# EAGLE design badge (EAGLE 7.1.0)
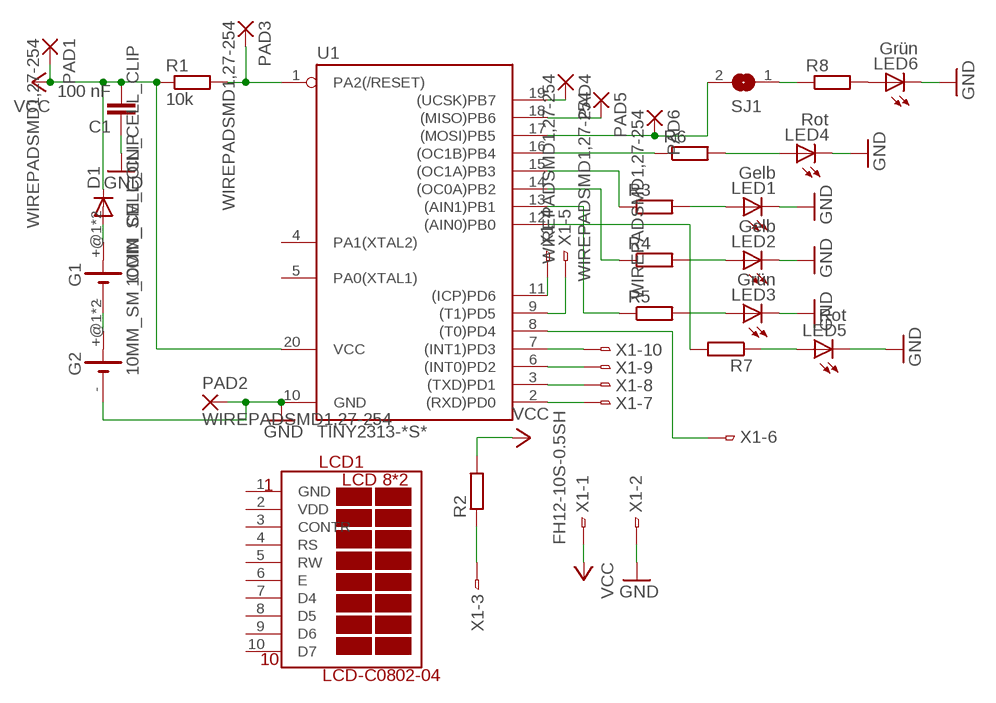
[diagram p0: schematic, sheet 1]

## Parts
C1  100 nF  C-EUC0805  [C0805]
D1  DIODE-MELF-MLL41  [MELF-MLL41]
G1  10MM_SM_COIN_CELL_CLIP  [10MM_SM_COIN_CELL_CLIP]
G2  10MM_SM_COIN_CELL_CLIP  [10MM_SM_COIN_CELL_CLIP]
LCD1  LCD-C0802-04  [LCD-C0802-04]
LED1  Gelb  LEDSML0603  [SML0603]
LED2  Gelb  LEDSML0603  [SML0603]
LED3  Grün  LEDSML0603  [SML0603]
LED4  Rot  LEDSML0603  [SML0603]
LED5  Rot  LEDSML0603  [SML0603]
LED6  Grün  LEDSML0603  [SML0603]
PAD1  WIREPADSMD1,27-254  [SMD1,27-2,54]
PAD2  WIREPADSMD1,27-254  [SMD1,27-2,54]
PAD3  WIREPADSMD1,27-254  [SMD1,27-2,54]
PAD4  WIREPADSMD1,27-254  [SMD1,27-2,54]
PAD5  WIREPADSMD1,27-254  [SMD1,27-2,54]
PAD6  WIREPADSMD1,27-254  [SMD1,27-2,54]
R1  10k  R-EU_R0805  [R0805]
R2  R-EU_R0805  [R0805]
R3  R-EU_R0603  [R0603]
R4  R-EU_R0805  [R0805]
R5  R-EU_R0805  [R0805]
R6  R-EU_R0805  [R0805]
R7  R-EU_R0805  [R0805]
R8  R-EU_R0805  [R0805]
SJ1  SJ  [SJ]
U1  TINY2313-*S*  [SO20L$]
X1  FH12-10S-0.5SH  [FH12-10S-0.5SH]

## Nets
GND: C1.1 G2.- LED1.C LED2.C LED3.C LED4.C LED5.C LED6.C PAD2.1(P) U1.10(GND) X1.2
N$1: PAD3.1(P) R1.2 U1.1(PA2(/RESET))
N$2: PAD5.1(P) U1.18((MISO)PB6)
N$3: PAD6.1(P) SJ1.2 U1.17((MOSI)PB5)
N$4: PAD4.1(P) U1.19((UCSK)PB7)
N$5: LED6.A R8.2
N$6: LED3.A R5.2
N$7: LED2.A R4.2
N$8: G1.- G2.+@1(+) G2.+@2(+)
N$9: LED4.A R6.2
N$10: R6.1 U1.16((OC1B)PB4)
N$11: R3.1 U1.15((OC1A)PB3)
N$12: R4.1 U1.14((OC0A)PB2)
N$13: R5.1 U1.13((AIN1)PB1)
N$14: U1.2((RXD)PD0) X1.7
N$15: U1.3((TXD)PD1) X1.8
N$16: U1.6((INT0)PD2) X1.9
N$17: U1.7((INT1)PD3) X1.10
N$18: U1.8((T0)PD4) X1.6
N$19: U1.9((T1)PD5) X1.5
N$20: U1.11((ICP)PD6) X1.4
N$21: R2.1 X1.3
N$24: R8.1 SJ1.1
N$36: LED1.A R3.2
N$37: D1.A G1.+@1(+) G1.+@2(+)
N$39: LED5.A R7.1
N$40: R7.2 U1.12((AIN0)PB0)
VCC: C1.2 D1.C PAD1.1(P) R1.1 R2.2 U1.20(VCC) X1.1
Unconnected: LCD1.3(CONTR) LCD1.4(RS) LCD1.5(RW) LCD1.6(E) LCD1.7(D4) LCD1.8(D5) LCD1.9(D6) LCD1.10(D7) U1.4(PA1(XTAL2)) U1.5(PA0(XTAL1))

## Power pins joined to a net without a drawn wire
GND: LCD1.1(GND)
VDD: LCD1.2(VDD)

## Library data of the parts
C1 = rcl:C-EU: CAPACITOR, European symbol
D1 = diode:DIODE-: DIODE
G1 G2 = battery:10MM_SM_COIN_CELL_CLIP: Battery cell clip for CR927 Source: KEYSTONE ELECTRONICS CORP. www.keyelco.com, ASTORIA, N.Y. 11105-2017 PART ANME 10mm SM COIN CELl CLIP DWG NO. 3030
LCD1 = lcd-c0802-04:LCD-C0802-04: Pollin LCD Display mit 2 Zeilen mit je 8 Zeichen. Wird wie ein 16*2 angesteuert (nur die ersten 8 Zeichen werden dargestellt).
LED1-LED6 = led:LED: LED OSRAM: - CHIPLED LG R971, LG N971, LY N971, LG Q971, LY Q971, LO R971, LY R971 LH N974, LH R974 LS Q976, LO Q976, LY Q976 LO Q996 - Hyper CHIPLED LW Q18S LB Q993, LB Q99A, LB R99A - SideLED LS A670, LO A670, LY A670, LG A670, LP A670 LB A673, LV A673, LT A673, LW A673 LH A674 LY A675 LS A676, LA A676, LO A676, LY A676, LW A676 LS A679, LY A679, LG A679 - Hyper Micro SIDELED® LS Y876, LA Y876, LO Y876, LY Y876 LT Y87S - SmartLED LW L88C, LW L88S LB L89C, LB L89S, LG L890 LS L89K, LO L89K, LY L89K LS L896, LA L896, LO L896, LY L896 - TOPLED LS T670, LO T670, LY T670, LG T670, LP T670 LSG T670, LSP T670, LSY T670, LOP T670, LYG T670 LG T671, LOG T671, LSG T671 LB T673, LV T673, LT T673, LW T673 LH T674 LS T676, LA T676, LO T676, LY T676, LB T676, LH T676, LSB T676, LW T676 LB T67C, LV T67C, LT T67C, LS T67K, LO T67K, LY T67K, LW E67C LS E67B, LA E67B, LO E67B, LY E67B, LB E67C, LV E67C, LT E67C LW T67C LS T679, LY T679, LG T679 LS T770, LO T770, LY T770, LG T770, LP T770 LB T773, LV T773, LT T773, LW T773 LH T774 LS E675, LA E675, LY E675, LS T675 LS T776, LA T776, LO T776, LY T776, LB T776 LHGB T686 LT T68C, LB T68C - Hyper Mini TOPLED® LB M676 - Mini TOPLED Santana® LG M470 LS M47K, LO M47K, LY M47K Source: http://www.osram.convergy.de LUXEON: - LUMILED® LXK2-PW12-R00, LXK2-PW12-S00, LXK2-PW14-U00, LXK2-PW14-V00 LXK2-PM12-R00, LXK2-PM12-S00, LXK2-PM14-U00 LXK2-PE12-Q00, LXK2-PE12-R00, LXK2-PE12-S00, LXK2-PE14-T00, LXK2-PE14-U00 LXK2-PB12-K00, LXK2-PB12-L00, LXK2-PB12-M00, LXK2-PB14-N00, LXK2-PB14-P00, LXK2-PB14-Q00 LXK2-PR12-L00, LXK2-PR12-M00, LXK2-PR14-Q00, LXK2-PR14-R00 LXK2-PD12-Q00, LXK2-PD12-R00, LXK2-PD12-S00 LXK2-PH12-R00, LXK2-PH12-S00 LXK2-PL12-P00, LXK2-PL12-Q00, LXK2-PL12-R00 Source: www.luxeon.com KINGBRIGHT: KA-3528ASYC Source: www.kingbright.com
PAD1-PAD6 = wirepad:WIREPAD: Wire PAD connect wire on PCB
R1-R8 = resistor:R-EU_: RESISTOR, European symbol; SPICEPREFIX: R
SJ1 = jumper:SJ: SMD solder JUMPER
U1 = avr-6:TINY2313*: Atmel Tiny2313 2K Flash, 128 bytes EEPROM, 128 bytes RAM
X1 = con-hirose:FH12-10S-0.5S: 0.5mm Pitch Connectors For FPC/FFC Source: Data sheet <http://www.hirose.co.jp/cataloge_hp/e58605370.pdf>; MPN: FH12-10S-0.5SH(55); OC_FARNELL: 1324540; OC_NEWARK: 34M6152

## Board
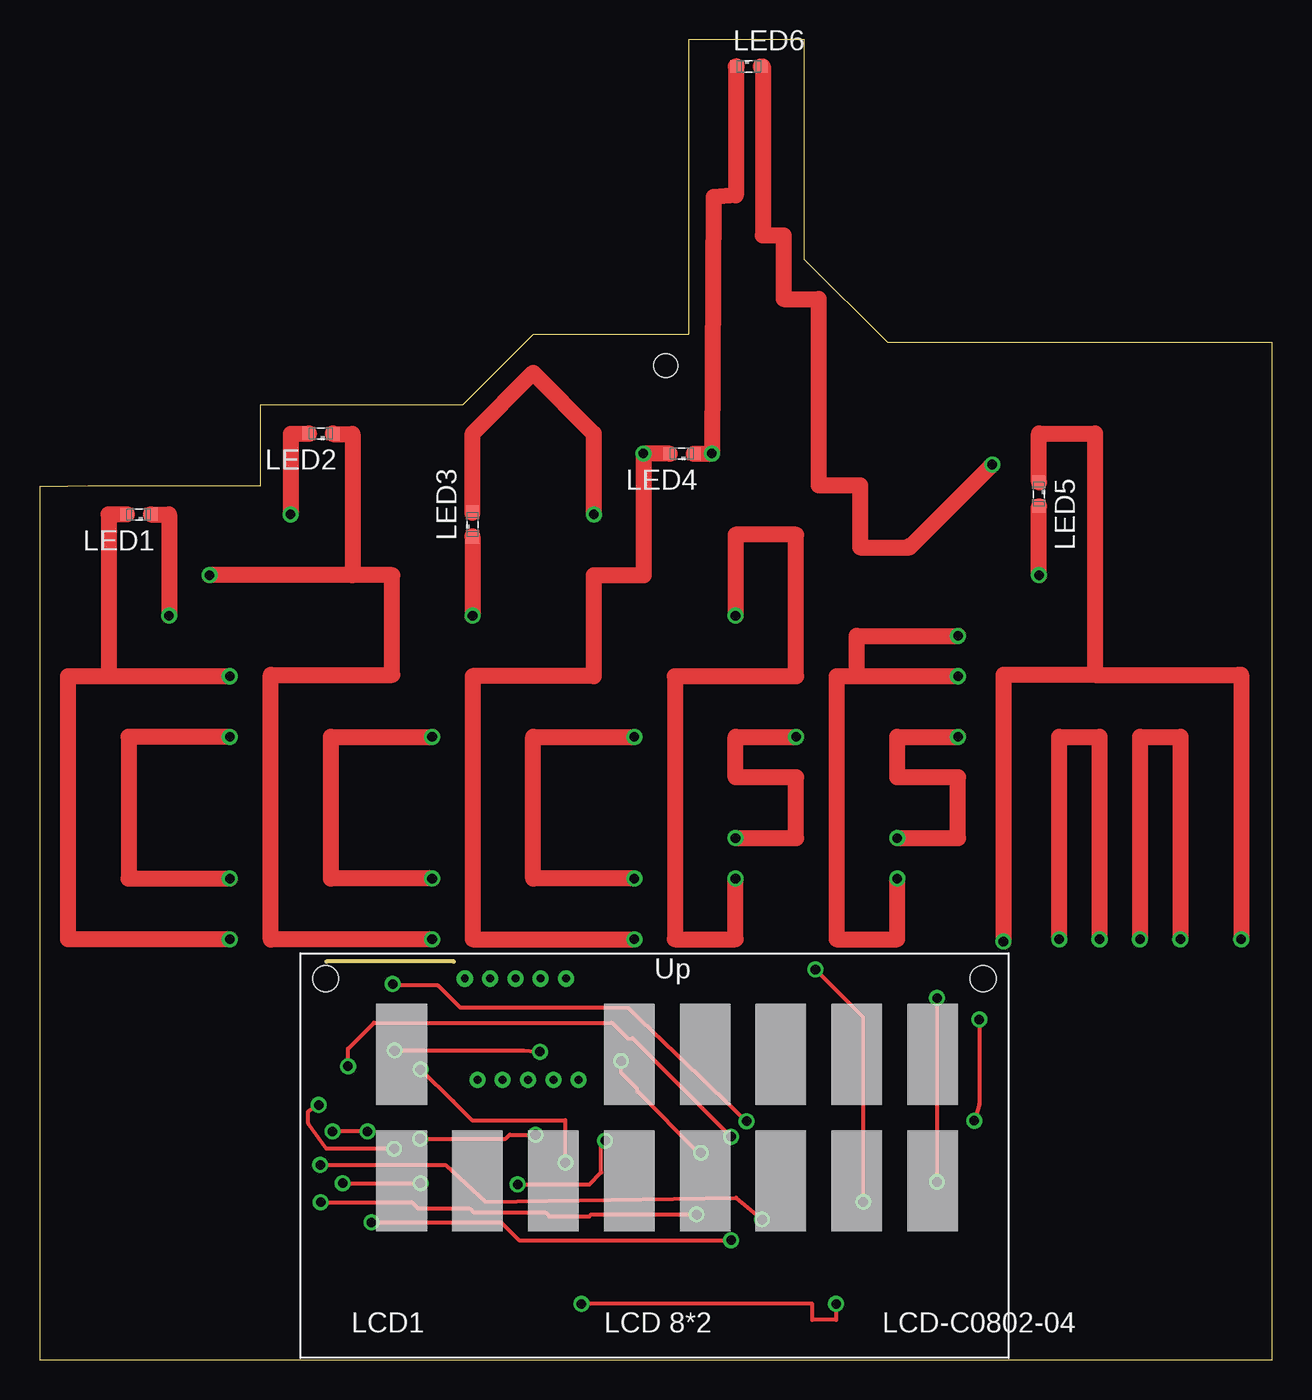
[diagram p1: board, top side]
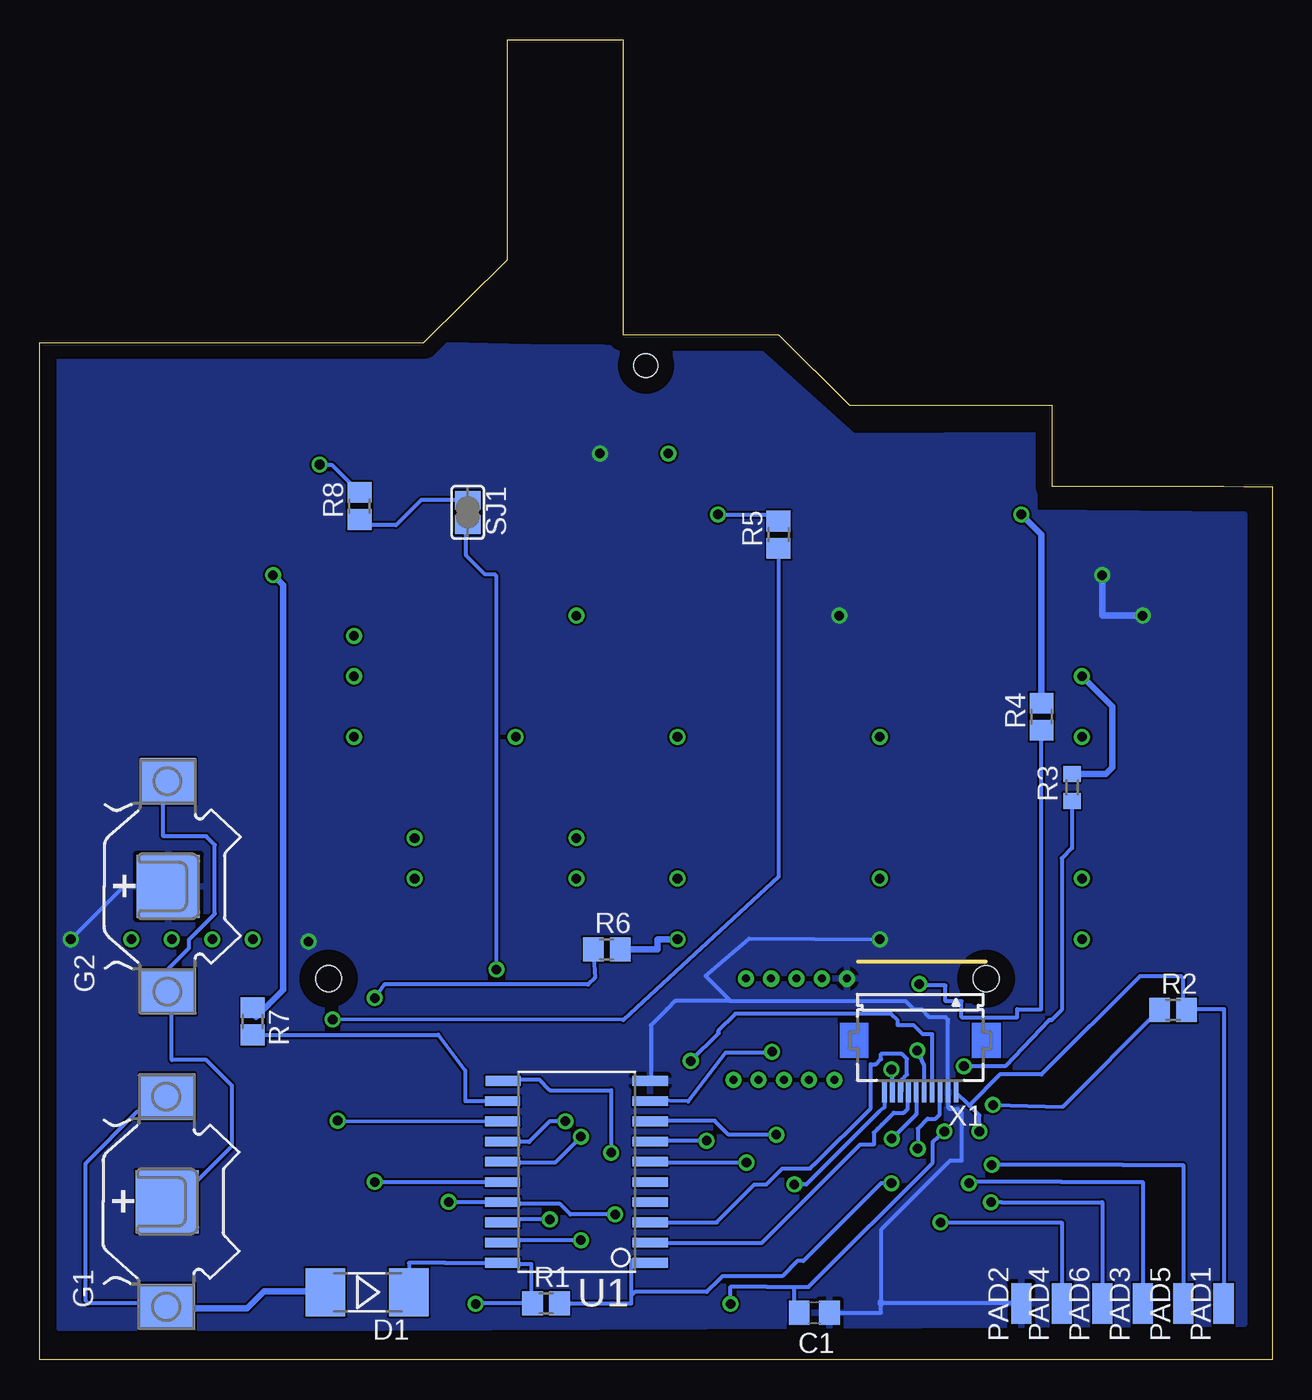
[diagram p2: board, bottom side, seen from below]

Size 77.37 x 82.87 mm. Coordinates in mm from the lower left corner, seen from the top.
Outline: 0,0 77.37,0 77.37,63.85 53.26,63.87 47.99,69.06 47.99,82.87 40.74,82.87 40.74,64.37 30.98,64.37 26.54,59.92 13.84,59.92 13.84,54.84 3.04,54.84 1.76,54.83 0,54.83 0,0
Copper layers (1*16): Top 0.035mm / dielectric 1.5mm / Bottom 0.035mm
Design rules "default *": minimum track width 10mil, minimum drill 6mil, track to track 5mil, track to pad 5mil, pad to pad 5mil, via to via 5mil, smd to smd 5mil, copper to edge 40mil, drill to drill 8mil, minimum pad ring 10mil, minimum via ring 8mil, stop-mask expansion 8mil, vias tented up to drill 0mil, thermal gap 10mil
Holes 1.5 mm at 39.31,62.41
Milling: 1 lines

### Footprints (pad centres in the part's own frame; a part is rotated, then mirrored left to right if it is on the bottom)
C0805 = smd 1.3 x 1.5: 1 -0.95,0; 2 0.95,0
MELF-MLL41 = smd 2.5 x 3: A 2.625,0; C -2.625,0
10MM_SM_COIN_CELL_CLIP = smd 2.9 x 3.5: +@1 -6.6,0; +@2 6.6,0 | smd 3.96 x 3.96: - 0,0
LCD-C0802-04 = drill 0.5: 1 -13.494,9.525; 2 -12.7,3.175; 3 -11.906,9.525; 4 -11.113,3.175; 5 -10.319,9.525; 6 -9.525,3.175; 7 -8.731,9.525; 8 -7.938,3.175; 9 -7.144,9.525; 10 -6.35,3.175 | hole 1.6: -22.225,9.525; 19.05,9.525
SML0603 = smd 0.8 x 0.8: A 0.75,0; C -0.75,0
SMD1,27-2,54 = smd 1.27 x 2.54: 1 0,0
R0805 = smd 1.3 x 1.5: 1 -0.85,0; 2 0.85,0
R0603 = smd 1 x 1.1: 1 -0.85,0; 2 0.85,0
SJ = smd 1.168 x 1.6: 1 -0.762,0; 2 0.762,0
SO20L$ = smd 0.61 x 2.21: 1 -5.715,-4.636; 2 -4.445,-4.636; 3 -3.175,-4.636; 4 -1.905,-4.636; 5 -0.635,-4.636; 6 0.635,-4.636; 7 1.905,-4.636; 8 3.175,-4.636; 9 4.445,-4.636; 10 5.715,-4.636; 11 5.715,4.61; 12 4.445,4.636; 13 3.175,4.636; 14 1.905,4.636; 15 0.635,4.636; 16 -0.635,4.636; 17 -1.905,4.636; 18 -3.175,4.636; 19 -4.445,4.636; 20 -5.715,4.636
FH12-10S-0.5SH = smd 0.3 x 1.3: 1 -2.25,3.25; 2 -1.75,3.25; 3 -1.25,3.25; 4 -0.75,3.25; 5 -0.25,3.25; 6 0.25,3.25; 7 0.75,3.25; 8 1.25,3.25; 9 1.75,3.25; 10 2.25,3.25

### Placement (x,y rotation side)
C1  28.74,2.95 180 bottom
D1  56.82,4.24 180 bottom
G1  69.38,9.92 90 bottom
G2  69.31,29.71 90 bottom
LCD1  40.18,14.4 0 top
LED1  6.21,53.07 180 top
LED2  17.64,58.15 180 top
LED3  27.17,52.44 90 top
LED4  40.3,56.88 180 top
LED5  62.73,54.34 270 top
LED6  44.52,81.2 0 top
PAD1  3.04,3.54 0 bottom
PAD2  15.74,3.54 0 bottom
PAD3  8.12,3.54 0 bottom
PAD4  13.2,3.54 0 bottom
PAD5  5.58,3.54 0 bottom
PAD6  10.66,3.54 0 bottom
R1  45.59,3.54 0 bottom
R2  6.21,21.95 0 bottom
R3  12.56,35.92 90 bottom
R4  14.47,40.37 90 bottom
R5  30.98,51.8 90 bottom
R6  41.77,25.77 0 bottom
R7  64,21.25 270 bottom
R8  57.3,53.6 90 bottom
SJ1  50.5,53.2 270 bottom
U1  43.68,11.79 90 bottom
X1  22.09,20.05 180 bottom

### Tracks (layer width: path | path; a pad name or v marks a point on that pad's centre or on a via)
GND  (via drill 0.6)
  Top 0.406: v10.66,49.25 v10.66,49.26 | 24.63,26.38 v24.63,26.4
  Top 1.016: LED5.C 62.73,58.15 66.25,58.15 | LED3.C v27.17,46.72 | 24.63,26.38 14.5,26.38 14.5,43 22.12,43 22.12,49.26 19.62,49.26 | 19.62,49.26 v10.66,49.26 | LED2.C 18.39,58.12 19.62,58.12 19.62,49.26 | 75.43,43 v75.43,26.4 | LED1.C 8.12,53.07 v8.12,46.72 | 66.25,58.15 66.25,58 | 66.25,58.15 66.25,43 | 66.25,43 60.5,43 v60.5,26.25 | 66.25,43 75.25,43 | LED4.C 42.2,56.88 v42.2,56.9 42.3,73 43.7,73.1 43.7,81.2 LED6.C
  Bottom 0.254: 24.55,3.62 24.55,8.15 20.34,12.36 20.2,12.5 19.5,12.5 19.5,15.5 19.75,15.75 20.25,15.75 20.34,15.84 X1.2 20.34,21.16 20.34,21.34 20.5,21.5 21.5,21.5 22,22 22.5,22 23,22.5 34,22.5 34,22.51 | G2.- 72.11,29.71 v75.43,26.4 | 24.61,26.38 v24.63,26.4 32.81,26.44 35.57,24.08 34,22.51 | PAD2.1 24.55,3.54 24.55,3.5 24.55,2.95 C1.1 | 34,22.51 37.49,22.51 38,22 39,21 39,17.55 U1.10 | v42.2,56.9 42.4,56.9
  Bottom 0.406: v8.12,46.72 10.66,46.72 v10.66,49.26 | 24.55,3.5 24.55,3.62
  pour Bottom: 1.74,2.24 1.74,53.08 14.94,53.18 14.94,58.04 26.3,58 32.39,63.49 46.66,63.59 50.5,63.66 51.94,63.66 52.8,62.8 76.24,62.8 76.14,2 55.74,2
N$1  (via drill 0.6)
  Top 0.254: v19.02,11.07 v23.9,11.07
  Bottom 0.254: v19.02,11.07 18.94,11.16 13.2,11.16 8.12,11.16 PAD3.1 | v23.9,11.07 24.55,11.07 29.43,6.2 29.8,6.2 30.75,5.25 34.5,5.25 34.75,5 35.5,4.25 40,4.25 40.25,4 | R1.2 40.25,3.54 40.25,4 | 38.85,5.89 U1.1 38.92,6.2 40.25,6.2 40.25,4
N$2  (via drill 0.6)
  Top 0.254: v17.61,12.23 25.47,12.23 27.98,9.93 43.73,10.18 v45.35,8.8
  Bottom 0.254: v17.61,12.23 9.35,12.23 5.58,12.23 PAD5.1 | v45.35,8.8 48.14,8.8 U1.18
N$3  (via drill 0.6)
  Top 0.254: v41.24,9.12 34.62,9.12 34.5,9 32,9 31.75,9.25 27.25,9.25 27,9.5 23.75,9.5 23.36,9.89 v17.64,9.89 | v51.7,9.9 51.7,21.5 v48.7,24.5
  Bottom 0.254: v17.64,9.89 17.01,9.89 10.66,9.89 PAD6.1 | v41.24,9.12 44.05,9.12 44.7,9.78 48.2,9.78 U1.17 v51.69,9.89 v51.7,9.9 | v48.7,24.5 48.7,49.2 48.8,49.3 49.4,49.3 50.6,50.5 50.6,52.34 SJ1.2
N$4  (via drill 0.6)
  Top 0.254: v20.82,8.62 28.95,8.62 30.07,7.5 v43.4,7.5
  Bottom 0.254: v43.4,7.5 48.17,7.5 U1.19 | v20.82,8.62 13.2,8.62 PAD4.1
N$5  (via drill 0.6)
  Top 1.016: LED6.A 45.4,81.2 45.4,70.6 46.7,70.6 46.7,66.6 48.9,66.6 48.9,54.9 51.5,54.9 51.5,51 54.6,51 54.6,51.1 54.7,51.1 v59.8,56.2
  Bottom 0.254: v59.8,56.2 59.05,56.2 R8.2
N$6  (via drill 0.6)
  Top 1.016: LED3.A 27.17,58.07 27.18,58.08 27.18,58.16 30.98,61.96 34.78,58.16 v34.78,53.08 v34.79,53.07
  Bottom 0.254: v34.79,53.07 31.4,53.07
  Bottom 0.406: 31.4,53.07 R5.2
N$7  (via drill 0.6)
  Top 1.016: LED2.A 16.89,58.12 15.75,58.12 v15.75,53.07 v15.74,53.07
  Bottom 0.406: v15.74,53.07 14.47,51.8 R4.2
N$8
  Bottom 0.254: G1.- 69.38,9.34 65.3,13.42 65.3,17.2 66.92,18.82 69.08,18.82 69.08,22.89 G2.+@1 69.31,24.54 68,25.84 68,26.38 66.38,28 66.38,32.32 66.92,32.86 69.62,32.86 69.62,36 G2.+@2
N$9  (via drill 0.6)
  Top 1.016: LED4.A 37.92,56.88 37.92,49.24 34.78,49.24 34.78,42.92 27.18,42.92 27.18,26.4 v37.33,26.4
  Bottom 0.406: v37.33,26.4 38.6,26.4 38.6,25.77 R6.2
N$10  (via drill 0.6)
  Top 0.254: v56.34,22.71 v56.34,11.16
  Bottom 0.254: R6.1 42.52,23.98 42.95,23.56 55.74,23.56 v56.34,22.71 | v56.34,11.16 U1.16
N$11  (via drill 0.6)
  Top 0.254: v19.35,18.43 19.35,19.52 20.98,21.15 35.92,21.15 36.9,20.18 37.23,20.18 v43.4,14
  Bottom 0.254: R3.1 12.56,32.11 13.2,31.48 13.2,21.95 13.84,21.32 13.98,21.32 16.75,18.43 v19.35,18.43 | v43.4,14 45.02,12.38 48.26,12.38 U1.15
N$12  (via drill 0.6)
  Top 0.254: v44.38,14.97 36.94,22.09 26.41,22.09 25.5,23 25,23.5 22.25,23.5 v22.16,23.59
  Bottom 0.254: v44.38,14.97 45.35,14.97 46.65,13.68 48.29,13.68 U1.14 | R4.1 14.5,39.49 14.5,22 16,22 16,21.5 19.5,21.5 19.5,22.5 20.5,22.5 20.5,23.5 22.16,23.5 v22.16,23.59
N$13  (via drill 0.6)
  Top 0.254: v58.98,21.36 58.98,16.05 v58.67,15.01
  Bottom 0.254: R5.1 30.98,30.32 40.73,21.32 v58.98,21.36 | v58.67,15.01 U1.13
N$14
  Bottom 0.254: X1.7 22.88,16.77 22.88,15.75 23.12,15.5 23.75,15.5 24.5,14.75 24.75,14.5 25,14.25 25,13.5 25.75,13.5 25.88,13.5 26.5,12.88 32.02,7.35 U1.2
N$15
  Bottom 0.254: X1.8 23.25,16.89 23.25,17.57 22.93,17.9 22.93,18.88 23.25,19.2 24.55,19.2 24.55,18.88 24.88,18.55 25.2,18.55 25.2,15.79 28.73,12.25 28.75,12.25 29,12 30.75,12 31.75,11 32.5,11 34.88,8.62 U1.3
N$16  (via drill 0.6)
  Top 0.254: v23.9,18.23 25.95,16.23 27.14,15.04 32.98,15.04 32.98,12.39 v33,12.38
  Bottom 0.254: X1.9 23.84,18.16 v23.9,18.23 | v33,12.38 38.99,12.38 U1.6
N$17  (via drill 0.6)
  Top 0.254: v30,11 34.5,11 35.25,11.75 35.25,13.5 v35.5,13.75
  Bottom 0.254: X1.10 24.34,15.84 24.66,15.59 29.25,11 29.5,11 v30,11 | v35.5,13.75 38.99,13.75 U1.7
N$18  (via drill 0.6)
  Top 0.254: v23.88,13.88 29.25,13.88 29.5,14.12 v31.12,14.12
  Bottom 0.254: X1.6 22.34,15.41 v23.88,13.88 | v31.12,14.12 34.12,14.12 35,15 39.01,15 U1.8
N$19  (via drill 0.6)
  Top 0.254: v22.27,19.41 30.4,19.41 v31.39,19.34
  Bottom 0.254: X1.5 21.84,18.44 v22.27,19.41 | U1.9 39.01,16.27 36.66,16.23 36.66,16.2 34.3,19.28 31.45,19.28 v31.39,19.34
N$20  (via drill 0.6)
  Top 0.254: v41.5,13 41.37,13 37.52,16.84 37.52,16.98 36.5,18 v36.5,18.75
  Bottom 0.254: X1.4 21.34,20.43 21.93,20.43 22,20.5 22.5,21 23.5,21 23.5,21.3 23.93,21.73 33.7,21.73 34.75,20.67 34.75,20.5 v36.5,18.75 | U1.11 48.23,17.57 46,17.57 45.35,16.93 41.5,16.93 v41.5,13
N$21  (via drill 0.6)
  Top 0.254: v22.25,13.25 18,13.25 16.86,14.83 16.86,15.58 v17.52,15.99
  Bottom 0.254: X1.3 20.88,16.8 20.88,15.38 21.12,15.12 21.62,15.12 22.25,14.5 v22.25,13.25 | v17.52,15.99 13.14,15.88 R2.1
N$23  (via drill 0.6)
  Top 1.016: v11.93,39.1 5.58,39.1 5.58,30.21 v11.93,30.21
N$24
  Bottom 0.254: SJ1.1 53.44,53.96 55,52.4 56.95,52.4 R8.1
N$25  (via drill 0.6)
  Top 1.016: v24.63,30.21 18.28,30.21 18.28,39.1 v24.63,39.1
N$27  (via drill 0.6)
  Top 1.016: v37.33,30.21 30.98,30.21 30.98,39.1 v37.33,39.1
N$28  (via drill 0.6)
  other vias: 37.9,56.9
N$29  (via drill 0.6)
  Top 1.016: v43.68,30.21 43.68,26.4 39.87,26.4 39.87,42.91 47.49,42.91 47.49,51.8 43.68,51.8 v43.68,46.72
N$30  (via drill 0.6)
  Top 1.016: v43.68,32.75 47.49,32.75 47.49,36.56 43.68,36.56 43.68,39.1 v47.49,39.1
N$31  (via drill 0.6)
  Top 1.016: v53.84,30.21 53.84,26.4 50.03,26.4 50.03,42.91 51.3,42.91 | 51.3,42.91 v57.65,42.91 | 51.3,42.91 51.3,45.45 v57.65,45.45
N$32  (via drill 0.6)
  Top 1.016: v53.84,32.75 57.65,32.75 57.65,36.56 53.84,36.56 53.84,39.1 v57.65,39.1
N$34  (via drill 0.6)
  Top 1.016: v64,26.4 64,39.1 66.54,39.1 v66.54,26.4
N$35  (via drill 0.6)
  Top 1.016: v69.08,26.4 69.08,39.1 71.62,39.1 v71.62,26.4
N$36  (via drill 0.6)
  Top 1.016: v11.93,26.4 1.77,26.4 1.77,42.91 4.31,42.91 | 4.31,42.91 v11.93,42.91 | LED1.A 4.31,53.07 4.31,42.91
  Bottom 0.406: v11.93,42.91 10.03,41.01 10.03,37.2 10.45,36.77 R3.2
N$37
  Bottom 0.254: 68.78,3.24 69.08,3.54 | 69.08,3.54 69.08,2.54 G1.+@1 | G1.+@2 69.52,15.58 71.24,15.58 74.48,12.34 74.48,3.7 74.32,3.54 69.08,3.54
  Bottom 0.406: 68.78,3.24 64.36,3.24 63.3,4.3 59.51,4.3 D1.A
N$39  (via drill 0.6)
  Top 1.016: v62.73,49.26 LED5.A
  Bottom 0.406: R7.1 63.78,21.54 62.09,23.23 62.09,48.62 v62.73,49.26
N$40
  Bottom 0.254: R7.2 52.35,20.39 50.66,18.14 50.66,16.24 U1.12
VCC  (via drill 0.6)
  Top 0.254: v20.57,14.32 v18.38,14.32 | v50,3.5 50,2.5 48.5,2.5 48.5,3.5 v34,3.5
  Bottom 0.254: 30,4.58 31.7,4.58 34,4.58 v34,3.5 | 30,4.58 29.1,4.58 21.3,12.38 21.3,13.68 v20.57,14.32 | v18.38,14.32 18.38,15.34 19.01,15.97 | 19.01,15.97 X1.1 | 5.58,21.95 5.58,23.95 5.7,24.07 8.3,24.07 14.47,17.9 17.07,17.9 19.01,15.97 | PAD1.1 3,3.54 3,22 5.37,22 R2.2 | C1.2 30,2.95 30,4.58 | D1.C 54.2,6.08 51.9,6.08 U1.20 48.32,6 46.5,6 46.5,3.54 R1.1 50,3.54 v50,3.5
  Bottom 0.61: 5.58,21.95 R2.2